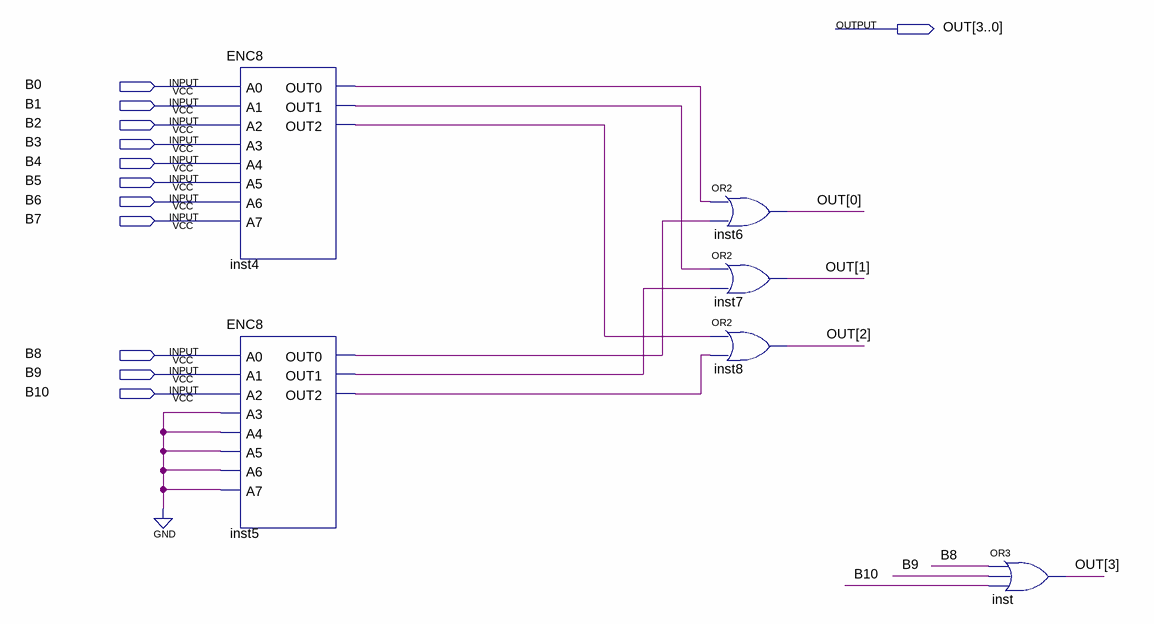
[diagram p0: schematic sheet]
// Quartus schematic ENC11.bdf as structural Verilog: 6 symbols, 12 pins
module ENC11 (
  input  B0,
  input  B1,
  input  B2,
  input  B3,
  input  B4,
  input  B5,
  input  B6,
  input  B7,
  input  B8,
  input  B9,
  input  B10,
  output [3:0] OUT
);

  wire inst4_out0, inst4_out1, inst4_out2, inst5_out0, inst5_out1, inst5_out2;

  ENC8 inst4 (
    .A0(B0), .A1(B1), .A2(B2), .A3(B3), .A4(B4), .A5(B5), .A6(B6), .A7(B7), .OUT0(inst4_out0),
    .OUT1(inst4_out1), .OUT2(inst4_out2));
  ENC8 inst5 (
    .A0(B8), .A1(B9), .A2(B10), .A3(1'b0), .A4(1'b0), .A5(1'b0), .A6(1'b0), .A7(1'b0), .OUT0(inst5_out0),
    .OUT1(inst5_out1), .OUT2(inst5_out2));
  or inst6 (OUT[0], inst4_out0, inst5_out0);
  or inst7 (OUT[1], inst4_out1, inst5_out1);
  or inst8 (OUT[2], inst4_out2, inst5_out2);
  or inst (OUT[3], B8, B9, B10);
endmodule
